# EAGLE design atividade_3 (EAGLE 9.6.2)
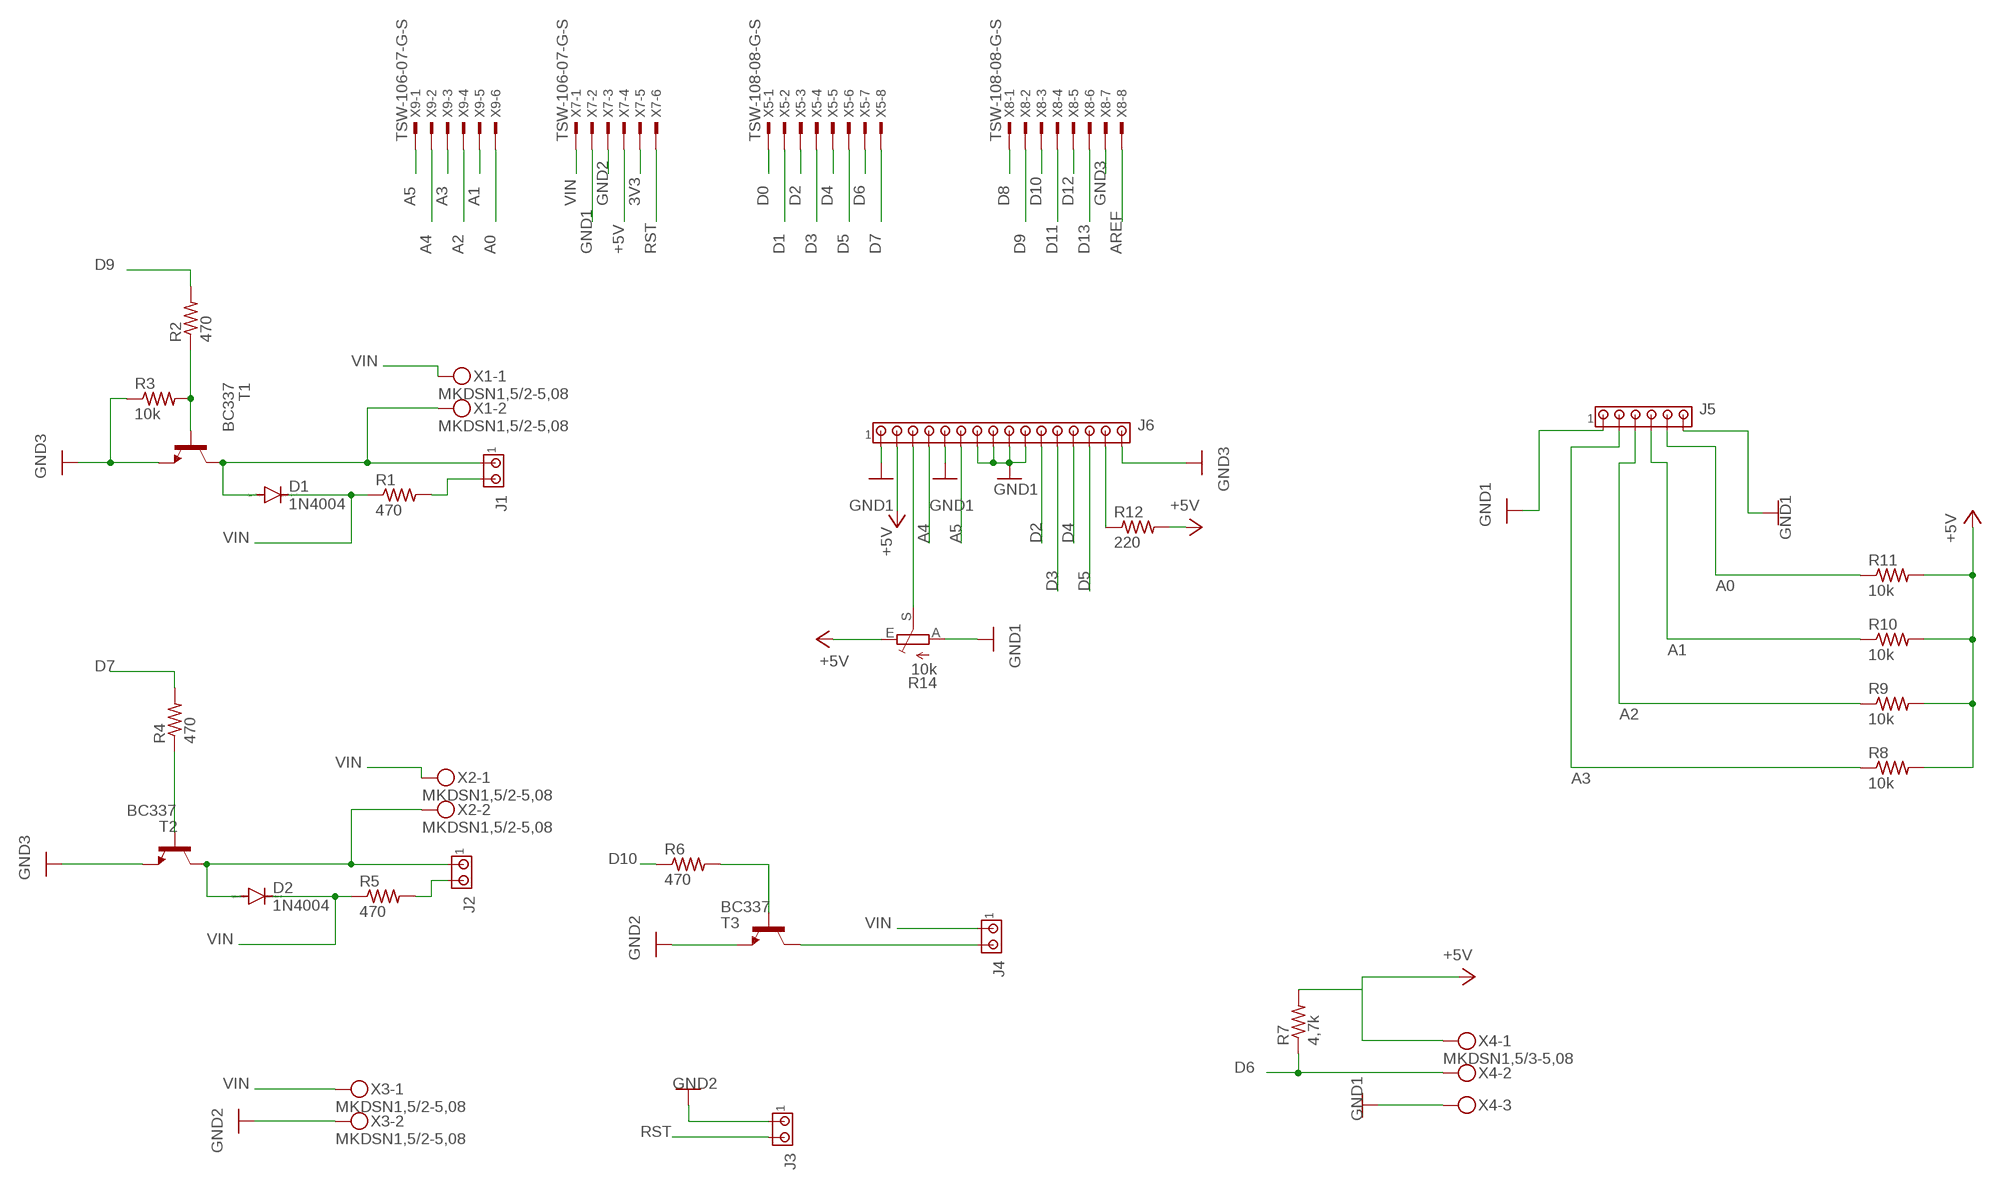
[diagram p0: schematic, sheet 1]

## Parts
D1  1N4004  [DO41-10]
D2  1N4004  [DO41-10]
J1  MTA02-100  [10X02MTA]
J2  MTA02-100  [10X02MTA]
J3  MTA02-100  [10X02MTA]
J4  MTA02-100  [10X02MTA]
J5  MTA06-100  [10X06MTA]
J6  MTA16-156  [1X16MTA]
R1  470  R-US_0204/7  [0204/7]
R2  470  R-US_0204/7  [0204/7]
R3  10k  R-US_0204/7  [0204/7]
R4  470  R-US_0204/7  [0204/7]
R5  470  R-US_0204/7  [0204/7]
R6  470  R-US_0204/7  [0204/7]
R7  4,7k  R-US_0204/7  [0204/7]
R8  10k  R-US_0204/7  [0204/7]
R9  10k  R-US_0204/7  [0204/7]
R10  10k  R-US_0204/7  [0204/7]
R11  10k  R-US_0204/7  [0204/7]
R12  220  R-US_0204/7  [0204/7]
R14  10k  TRIM_EU-CA6H  [CA6H]
T1  BC337  [TO92]
T2  BC337  [TO92]
T3  BC337  [TO92]
X1  MKDSN1,5/2-5,08  [MKDSN1,5/2-5,08]
X2  MKDSN1,5/2-5,08  [MKDSN1,5/2-5,08]
X3  MKDSN1,5/2-5,08  [MKDSN1,5/2-5,08]
X4  MKDSN1,5/3-5,08  [MKDSN1,5/3-5,08]
X5  TSW-108-08-G-S  [TSW-108-XX-G-S]
X7  TSW-106-07-G-S  [TSW-106-XX-G-S]
X8  TSW-108-08-G-S  [TSW-108-XX-G-S]
X9  TSW-106-07-G-S  [TSW-106-XX-G-S]

## Nets
3V3: X7.5
+5V: J6.2 R7.2 R8.2 R9.2 R10.2 R11.2 R12.2 R14.E X4.1 X7.4
A0: J5.5 R11.1 X9.6
A1: J5.4 R10.1 X9.5
A2: J5.3 R9.1 X9.4
A3: J5.2 R8.1 X9.3
A4: J6.4 X9.2
A5: J6.6 X9.1
AREF: X8.8
D0: X5.1
D1: X5.2
D2: J6.11 X5.3
D3: J6.12 X5.4
D4: J6.13 X5.5
D5: J6.14 X5.6
D6: R7.1 X4.2 X5.7
D7: R4.2 X5.8
D8: X8.1
D9: R2.2 X8.2
D10: R6.1 X8.3
D11: X8.4
D12: X8.5
D13: X8.6
GND1: J5.1 J5.6 J6.1 J6.5 J6.7 J6.8 J6.9 J6.10 R14.A X4.3 X7.2 ; supply symbol labelled GND
GND2: J3.1 T3.1(E) X3.2 X7.3 ; supply symbol labelled GND
GND3: J6.16 R3.1 T1.1(E) T2.1(E) X8.7 ; supply symbol labelled GND
N$1: D1.A J1.1 T1.3(C) X1.2
N$2: D2.A J2.1 T2.3(C) X2.2
N$3: J1.2 R1.2
N$4: J2.2 R5.2
N$5: R2.1 R3.2 T1.2(B)
N$6: R4.1 T2.2(B)
N$7: R6.2 T3.2(B)
N$8: J4.2 T3.3(C)
N$9: J6.3 R14.S
N$10: J6.15 R12.1
RST: J3.2 X7.6
VIN: D1.C D2.C J4.1 R1.1 R5.1 X1.1 X2.1 X3.1 X7.1

## Library data of the parts
D1 D2 = diode:1N4004: DIODE general purpose rectifier, 1 A
J1-J4 = con-amp:MTA02-100: AMP connector
J5 = con-amp:MTA06-100: AMP connector Connection corrected 2014-09-19
J6 = con-amp:MTA16-156: AMP connector
R1-R12 = rcl:R-US_: RESISTOR, American symbol; SPICEPREFIX: R
R14 = pot:TRIM_EU-: POTENTIOMETER
T1-T3 = transistor:BC337: NPN TRANSISTOR
X1-X3 = con-phoenix-508:MKDSN1,5/2-5,08: MKDSN 1,5/ 2-5,08 Printklemme Nennstrom: 13,5 A Nennspannung: 250 V Rastermaß: 5,08 mm Polzahl: 2 Anschlussart: Schraubanschluss Montage: Löten Anschlussrichtung Leiter/Platine: 0 ° Artikelnummer: 1729128 Source: http://eshop.phoenixcontact.com .. 1729128.pdf
X4 = con-phoenix-508:MKDSN1,5/3-5,08: MKDSN 1,5/ 3-5,08 Printklemme Nennstrom: 13,5 A Nennspannung: 250 V Rastermaß: 5,08 mm Polzahl: 3 Anschlussart: Schraubanschluss Montage: Löten Anschlussrichtung Leiter/Platine: 0 ° Artikelnummer: 1729131 Source: http://eshop.phoenixcontact.com .. 1729131.pdf
X5 X8 = con-samtec:TSW-108-*-G-S: THROUGH-HOLE .025" SQ POST HEADER Source: Samtec TSW.pdf; MF: Samtec Inc.; MPN: TSW-108-07-G-S
X7 X9 = con-samtec:TSW-106-*-G-S: THROUGH-HOLE .025" SQ POST HEADER Source: Samtec TSW.pdf; MF: Samtec Inc.; MPN: TSW-106-07-G-S

## Board
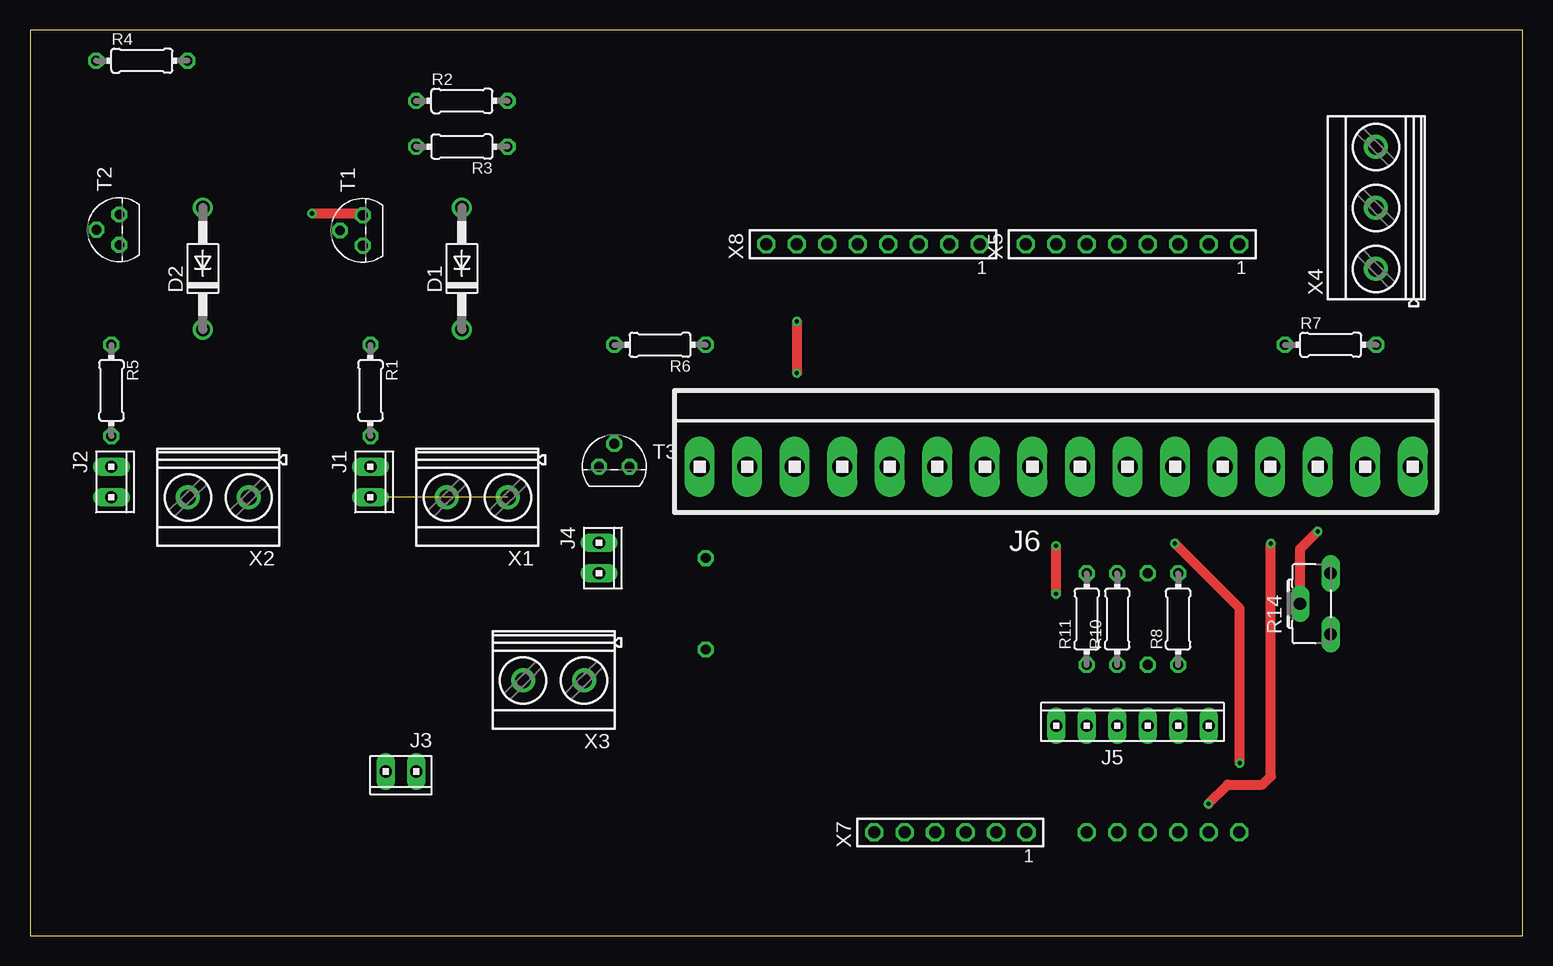
[diagram p1: board, top side]
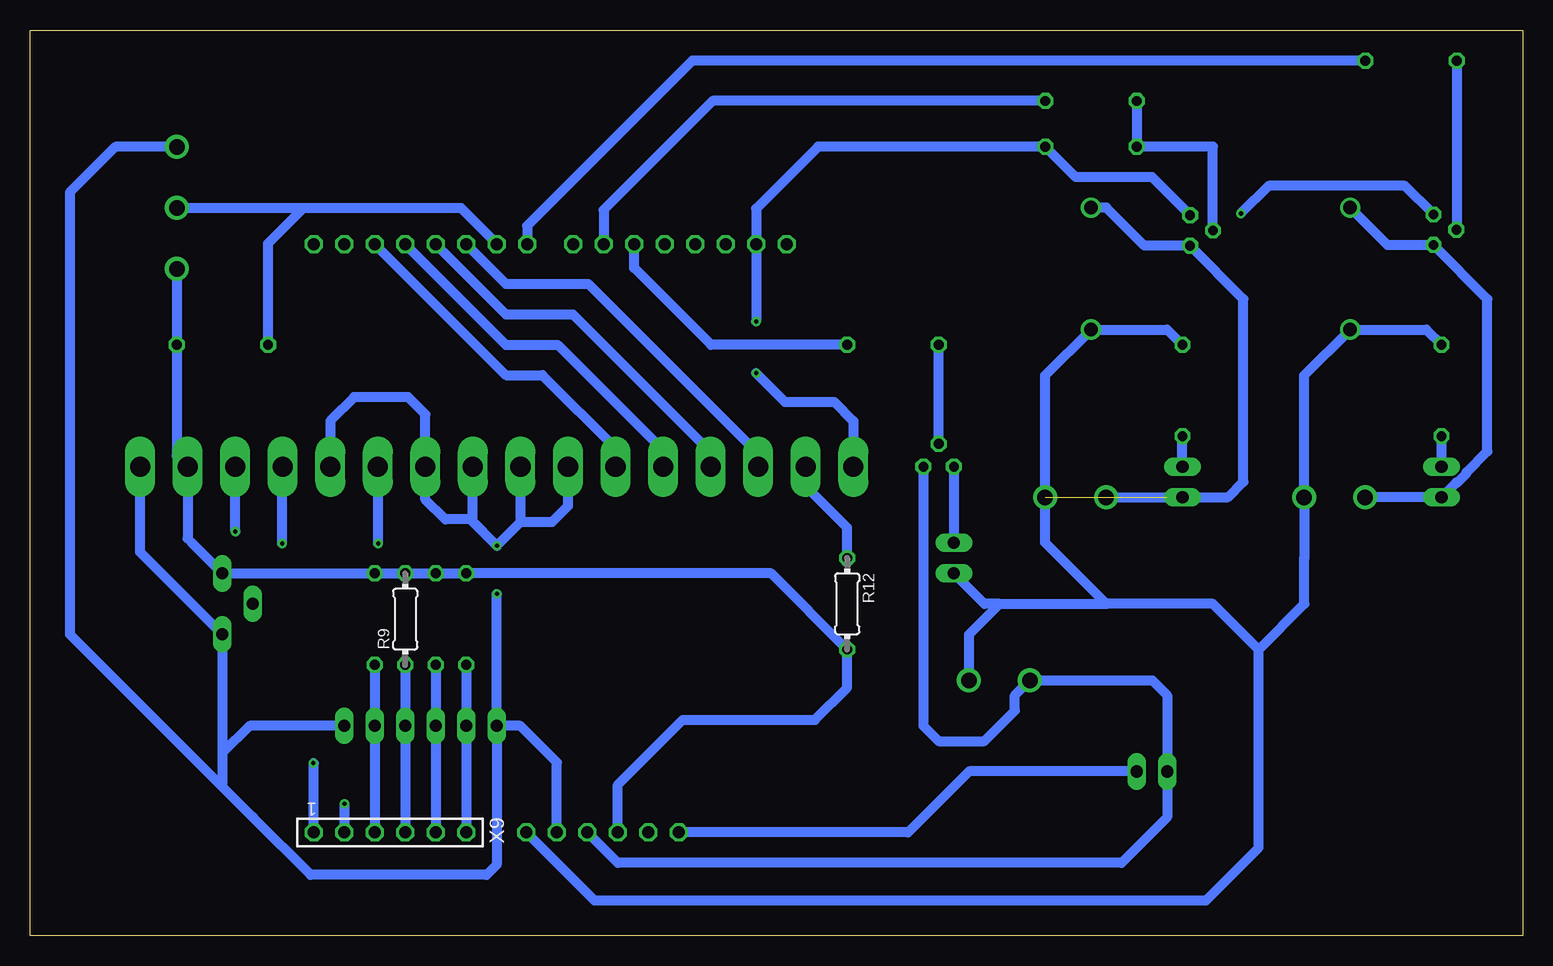
[diagram p2: board, bottom side, seen from below]

Size 124.41 x 75.49 mm. Coordinates in mm from the lower left corner, seen from the top.
Outline: 0,0 124.41,0 124.41,75.49 0,75.49 0,0
Copper layers (1*16): Top 0.035mm / dielectric 1.5mm / Bottom 0.035mm
Design rules "default": minimum track width 6mil, minimum drill 0.35mm, track to track 6mil, track to pad 6mil, pad to pad 6mil, via to via 6mil, smd to smd 6mil, copper to edge 40mil, drill to drill 6mil, minimum pad ring 10mil, minimum via ring 8mil, stop-mask expansion 4mil, vias tented up to drill 0mil, thermal gap 10mil

### Footprints (pad centres in the part's own frame; a part is rotated, then mirrored left to right if it is on the bottom)
DO41-10 = drill 1.118: A 5.08,0; C -5.08,0
10X02MTA = drill 1.016 long: 1 1.27,0; 2 -1.27,0
10X06MTA = drill 1.016 long: 1 6.35,0; 2 3.81,0; 3 1.27,0; 4 -1.27,0; 5 -3.81,0; 6 -6.35,0
1X16MTA = drill 1.676 long: 1 29.718,0; 2 25.756,0; 3 21.793,0; 4 17.831,0; 5 13.868,0; 6 9.906,0; 7 5.944,0; 8 1.981,0; 9 -1.981,0; 10 -5.944,0; 11 -9.906,0; 12 -13.868,0; 13 -17.831,0; 14 -21.793,0; 15 -25.756,0; 16 -29.718,0
0204/7 = drill 0.813 octagon: 1 -3.81,0; 2 3.81,0
CA6H = drill 1.016 long: A -2.54,0; E 2.54,0; S 0,2.54
TO92 = drill 0.813 octagon: 1 1.27,0; 2 0,1.905; 3 -1.27,0
MKDSN1,5/2-5,08 = drill 1.3 pad 2: 1 -2.561,0.025; 2 2.519,0.025
MKDSN1,5/3-5,08 = drill 1.3 pad 2: 1 -7.641,0.025; 2 -2.561,0.025; 3 2.519,0.025
TSW-108-XX-G-S = drill 1 pad 1.5 octagon: 1 8.89,0; 2 6.35,0; 3 3.81,0; 4 1.27,0; 5 -1.27,0; 6 -3.81,0; 7 -6.35,0; 8 -8.89,0
TSW-106-XX-G-S = drill 1 pad 1.5 octagon: 1 6.35,0; 2 3.81,0; 3 1.27,0; 4 -1.27,0; 5 -3.81,0; 6 -6.35,0

### Placement (x,y rotation side)
D1  35.99,55.61 90 top
D2  14.4,55.61 90 top
J1  28.37,37.83 270 top
J2  6.78,37.83 270 top
J3  30.91,13.7 180 top
J4  47.42,31.48 270 top
J5  91.87,17.51 0 top
J6  85.52,39.1 0 top
R1  28.37,45.45 270 top
R2  35.99,69.58 0 top
R3  35.99,65.77 180 top
R4  9.32,72.93 0 top
R5  6.78,45.45 270 top
R6  52.5,49.26 180 top
R7  108.38,49.26 0 top
R8  95.68,26.4 90 top
R9  93.14,26.4 90 bottom
R10  90.6,26.4 90 top
R11  88.06,26.4 90 top
R12  56.31,27.67 270 bottom
R14  108.38,27.67 90 top
T1  27.73,58.78 90 top
T2  7.45,58.85 90 top
T3  48.69,39.1 0 top
X1  37.26,36.56 180 top
X2  15.67,36.56 180 top
X3  43.61,21.32 180 top
X4  112.19,63.23 90 top
X5  91.87,57.64 0 top
X7  76.69,8.62 0 top
X8  70.25,57.64 0 top
X9  94.41,8.62 180 bottom

### Tracks (layer width: path | path; a pad name or v marks a point on that pad's centre or on a via)
+5V
  Bottom 0.152: 111.28,33.11 110.92,32.75
  Bottom 0.813: X4.1 112.17,49.28 R7.2 112.19,40.01 J6.2 111.28,33.11 | 110.92,32.75 R14.E R8.2 R9.2 R10.2 R11.2 62.66,30.21 R12.2 56.31,20.69 59,18 70,18 75.42,12.58 X7.4
A0
  Bottom 0.813: R11.1 J5.5 X9.6
A1
  Bottom 0.813: R10.1 J5.4 X9.5
A2
  Bottom 0.813: R9.1 J5.3 X9.4
A3
  Bottom 0.813: R8.1 J5.2 X9.3
A4  (via drill 0.35)
  Top 0.813: v98.2,11 99.8,12.6 102.7,12.6 103.4,13.3 v103.4,32.7
  Bottom 0.813: X9.2 98.2,8.64 v98.2,11 | v103.4,32.7 103.4,39.05 J6.4
A5  (via drill 0.35)
  Top 0.813: v100.8,14.4 100.8,27.3 v95.4,32.7
  Bottom 0.813: X9.1 100.76,14.36 v100.8,14.4 | v95.4,32.7 95.4,39.07 J6.6
D2
  Bottom 0.152: X5.3 94.41,56.37
  Bottom 0.813: X5.3 84.76,46.72 81.71,46.72 75.61,40.62 J6.11
D3
  Bottom 0.813: X5.4 84.76,49.26 80.44,49.26 71.65,40.47 J6.12
D4
  Bottom 0.813: X5.5 84.76,51.8 79.17,51.8 67.69,40.32 J6.13
D5
  Bottom 0.813: X5.6 84.76,54.34 77.9,54.34 63.73,40.17 J6.14
D6
  Bottom 0.813: X4.2 101.6,60.67 | 101.6,60.67 88.51,60.67 85.52,57.68 X5.7 | R7.1 104.57,57.7 101.6,60.67
D7
  Bottom 0.813: R4.2 69.21,72.93 82.98,59.16 X5.8
D9
  Bottom 0.813: X8.2 76.6,60.5 67.52,69.58 R2.2
D10
  Bottom 0.813: R6.1 67.66,49.26 74.06,55.66 X8.3
GND1  (via drill 0.35)
  Top 0.813: v85.5,28.5 v85.5,32.5
  Bottom 0.152: 108.38,12.43 105.84,9.89 | 108.38,12.7 108.38,12.43 | 108.38,12.43 121.08,25.13
  Bottom 0.813: X4.3 117.29,65.75 121.08,61.96 121.08,25.13 105.84,9.89 101.03,5.08 86.36,5.08 85.52,5.92 J5.6 | X7.2 80.5,14.46 83.55,17.51 J5.6 | 108.38,15.24 R14.A 115.24,31.99 J6.1 | 108.38,15.24 108.38,12.7 | J5.1 106.11,17.51 108.38,15.24 | J5.6 85.52,28.48 v85.5,28.5 | v85.5,32.5 83.5,34.5 | 83.5,34.5 80.9,34.5 79.58,35.82 J6.10 | 83.5,34.5 83.5,39.06 J6.9 | v85.5,32.5 87.5,34.5 J6.8 | v85.5,32.5 87.7,34.7 89.8,34.7 91.46,36.36 J6.7 91.46,43.46 92.9,44.9 97.4,44.9 99.39,42.91 J6.5
GND2
  Bottom 0.152: X3.2
  Bottom 0.813: T3.1 49.96,17.51 48.69,16.24 44.88,16.24 42.34,18.78 42.34,20.05 X3.2 | X3.2 30.89,21.3 29.64,20.05 J3.1 29.64,9.89 33.45,6.08 75.42,6.08 X7.3
GND3  (via drill 0.35)
  Top 0.813: v63.9,51.2 v63.9,46.9 | v23.5,60.2 27.59,60.2 T1.1
  Bottom 0.813: T1.1 30.91,63.23 37.26,63.23 R3.1 58.73,65.77 63.9,60.6 X8.7 v63.9,51.2 | v63.9,46.9 61.5,44.5 57.4,44.5 55.8,42.9 J6.16 | T2.1 9.83,62.5 21.2,62.5 v23.5,60.2
N$1
  Bottom 0.813: X1.2 34.72,36.56 J1.1 24.56,36.56 23.29,37.83 23.29,53.07 T1.3 31.55,57.52 34.72,60.69 D1.A
N$2
  Bottom 0.152: J2.1 2.97,40.37 | 13.13,36.56 X2.2
  Bottom 0.813: D2.A 11.29,57.58 T2.3 7.45,57.55 2.97,53.07 2.97,40.37 4.7,38.64 4.7,38.55 5.47,37.78 5.56,37.78 J2.1 13.13,36.56
N$3
  Bottom 0.813: J1.2 R1.2
N$4
  Bottom 0.813: J2.2 R5.2
N$5
  Bottom 0.813: T1.2 25.83,65.77 R3.2 R2.1
N$6
  Bottom 0.813: R4.1 5.51,58.88 T2.2
N$7
  Bottom 0.152: 48.69,49 R6.2
  Bottom 0.813: T3.2 48.69,49
N$8
  Bottom 0.813: T3.3 J4.2
N$9  (via drill 0.35)
  Top 0.813: R14.S 105.84,32.24 v107.3,33.7
  Bottom 0.813: v107.3,33.7 107.3,39.09 J6.3
  other vias: 105.84,27.67
N$10
  Bottom 0.152: 59.76,38 J6.15
  Bottom 0.813: R12.1 56.31,34.02 59.76,37.47 59.76,38
RST
  Bottom 0.813: J3.2 46.15,13.7 51.23,8.62 X7.6
VIN  (1 unrouted)
  Bottom 0.152: 18.21,36.51 X2.1 18.18,36.53 | X1.1 39.82,36.56 | 46.17,21.32 X3.1 | 29.64,36.56 29.66,36.56
  Bottom 0.813: X7.1 77.38,2.96 26.41,2.96 22.02,7.35 22.02,23.86 | 43.61,27.67 34.72,27.67 | 43.61,27.67 46.17,25.11 46.17,21.32 | 43.61,27.67 44.88,27.67 J4.1 | X1.1 39.8,36.56 | R1.1 29.64,50.53 D1.C 39.82,46.7 X1.1 | 18.23,31.48 X2.1 18.23,46.7 D2.C 8.05,50.53 R5.1 | 18.23,31.48 18.23,31.46 | X1.1 39.82,32.77 34.72,27.67 | 22.02,23.86 18.21,27.67 18.21,31.48 18.23,31.48 | 22.02,23.86 25.83,27.67 34.72,27.67